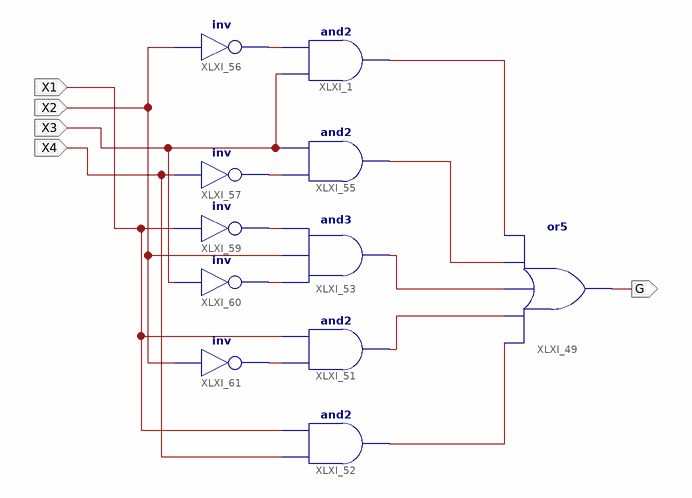
[diagram p0: schematic sheet 1]
// Xilinx ISE schematic bin7seg_g.sch (spartan3e) as structural Verilog: 11 symbols, 5 ports
module bin7seg_g (
  input  X1,
  input  X2,
  input  X3,
  input  X4,
  output G
);

  wire XLXN_1, XLXN_2, XLXN_3, XLXN_9, XLXN_55, XLXN_56, XLXN_57, XLXN_58, XLXN_59, XLXN_60;

  and XLXI_1 (XLXN_1, X3, XLXN_56);
  or XLXI_49 (G, XLXN_55, XLXN_9, XLXN_3, XLXN_2, XLXN_1);
  and XLXI_51 (XLXN_9, XLXN_60, X1);
  and XLXI_52 (XLXN_55, X4, X1);
  and XLXI_53 (XLXN_3, XLXN_59, X2, XLXN_58);
  and XLXI_55 (XLXN_2, XLXN_57, X3);
  not XLXI_56 (XLXN_56, X2);
  not XLXI_57 (XLXN_57, X4);
  not XLXI_59 (XLXN_58, X1);
  not XLXI_60 (XLXN_59, X3);
  not XLXI_61 (XLXN_60, X2);
endmodule
